# Altium schematic sheet LCD.SchDoc
size A4; Organization: Altium Limited; Address1: L3, 12a Rodborough Rd; Address2: Frenchs Forest; Address3: NSW; Address4: Australia 2086
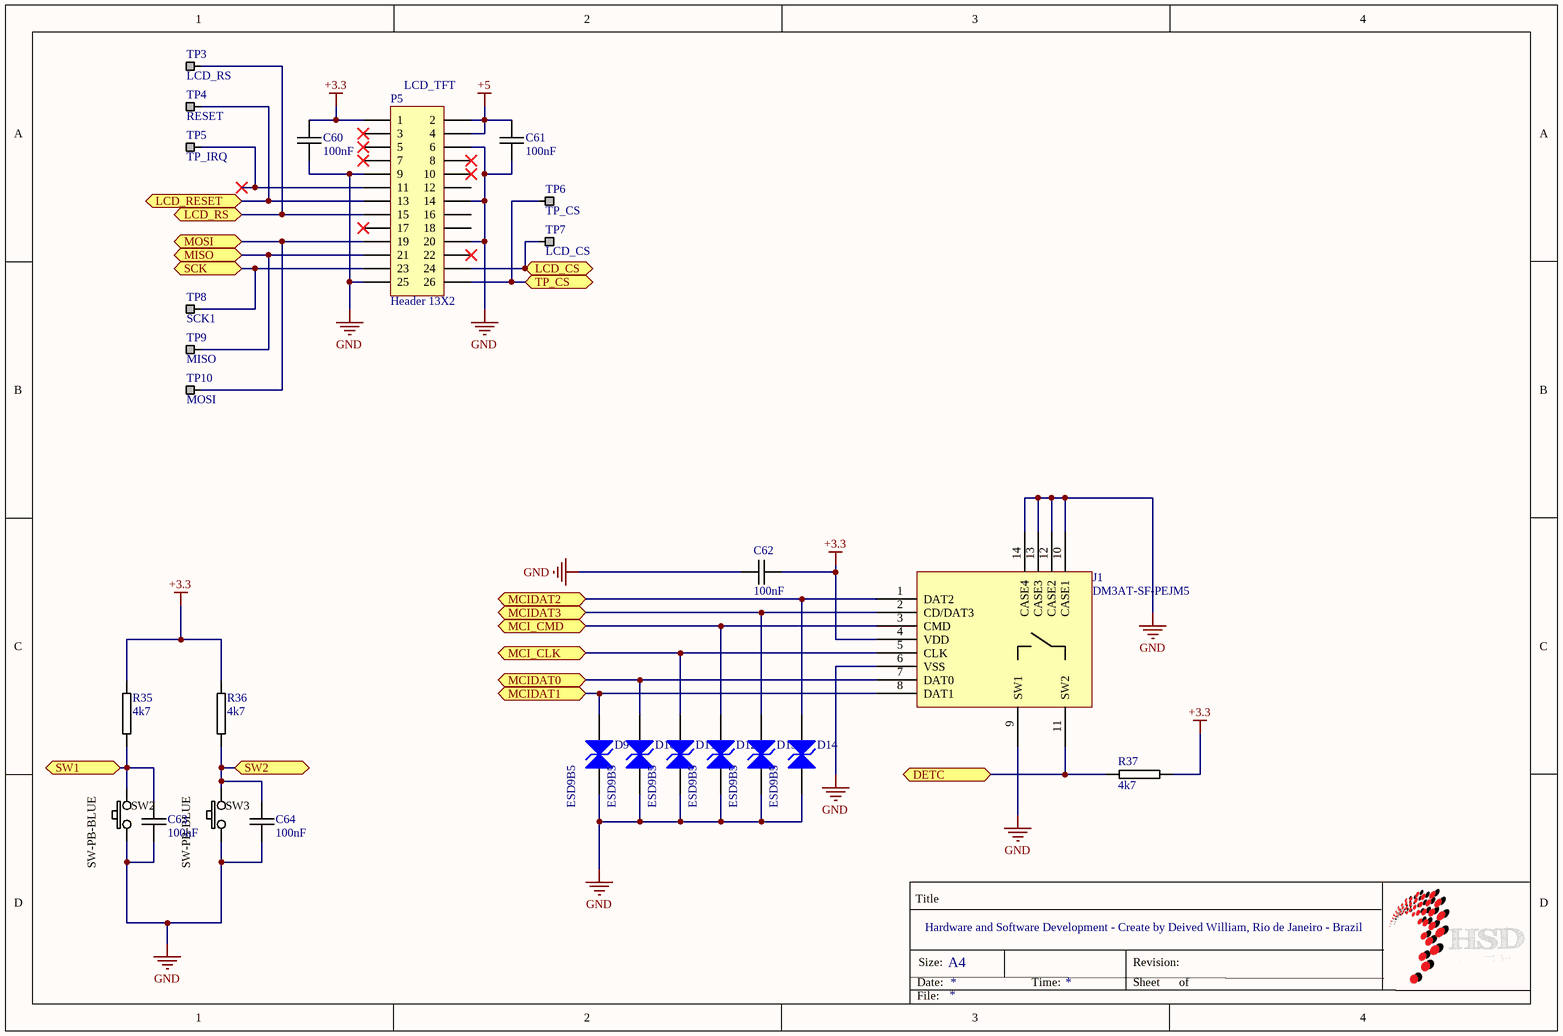
[diagram p0: LCD.SchDoc]

## Parts
C60  100nF  [0603C-GENERIC]
C61  100nF  [0603C-GENERIC]
C62  100nF  [0603C-GENERIC]
C63  100nF  [0603C-GENERIC]
C64  100nF  [0603C-GENERIC]
D9  ESD9B5  [SOD-923]
D10  ESD9B5  [SOD-923]
D11  ESD9B5  [SOD-923]
D12  ESD9B5  [SOD-923]
D13  ESD9B5  [SOD-923]
D14  ESD9B5  [SOD-923]
J1  DM3AT-SF-PEJM5  [SD CARD MICRO]
P5  Header 13X2  [HDR2X13]
R35  4k7  [0603R-100]
R36  4k7  [0603R-100]
R37  4k7  [0603R-100]
SW2  SW-PB-BLUE  [SW-PB-BLUE-ROUND4]
SW3  SW-PB-BLUE  [SW-PB-BLUE-ROUND4]
TP3  LCD_RS  [TESTPIN]
TP4  RESET  [TESTPIN]
TP5  TP_IRQ  [TESTPIN]
TP6  TP_CS  [TESTPIN]
TP7  LCD_CS  [TESTPIN]
TP8  SCK1  [TESTPIN]
TP9  MISO  [TESTPIN]
TP10  MOSI  [TESTPIN]

## Ports
DETC, LCD_CS, LCD_RESET, LCD_RS, MCI_CLK, MCI_CMD, MCIDAT0, MCIDAT1, MCIDAT2, MCIDAT3, MISO, MOSI, SCK, SW1, SW2, TP_CS

## Nets
+3.3: C60.1 C62.2 J1.4(VDD) P5.1 R35.2 R36.2 R37.2
+5: C61.1 P5.2 P5.4
GND: C60.2 C61.2 C62.1 C63.2 C64.2 D9.1 D10.1 D11.1 D12.1 D13.1 D14.1 J1.6(VSS) J1.9(SW1) J1.10(CASE1) J1.12(CASE2) J1.13(CASE3) J1.14(CASE4) P5.6 P5.9 P5.14 P5.20 P5.25 SW2.1 SW3.1
DETC: J1.11(SW2) R37.1 ; port DETC
LCD_CS: P5.24 TP7.1 ; port LCD_CS
LCD_RESET: P5.13 TP4.1 ; port LCD_RESET
LCD_RS: P5.15 TP3.1 ; port LCD_RS
MCI_CLK: D11.2 J1.5(CLK) ; port MCI_CLK
MCI_CMD: D12.2 J1.3(CMD) ; port MCI_CMD
MCIDAT0: D10.2 J1.7(DAT0) ; port MCIDAT0
MCIDAT1: D9.2 J1.8(DAT1) ; port MCIDAT1
MCIDAT2: D14.2 J1.1(DAT2) ; port MCIDAT2
MCIDAT3: D13.2 J1.2(CD/DAT3) ; port MCIDAT3
MISO: P5.21 TP9.1 ; port MISO
MOSI: P5.19 TP10.1 ; port MOSI
SCK: P5.23 TP8.1 ; port SCK
SW1: C63.1 R35.1 SW2.2 ; port SW1
SW2: C64.1 R36.1 SW3.2 ; port SW2
TP_CS: P5.26 TP6.1 ; port TP_CS
NetP5_11: P5.11 TP5.1

Not connected (* = marked no-connect by the designer): P5 3* 5* 7* 8* 10* 12 16 17* 18 22*

## Notes on the sheet
- (near P5) LCD_TFT
- Title
- Date:
- Size:
- Hardware and Software Development - Create by Deived William, Rio de Janeiro - Brazil
- A4
- Time:
- Revision:
- Sheet
- of
- File:

## Library data of the parts
C60-C64 = 0603C-100NF-25V-X7R-TDK: CAPACITOR 0603 CERAMIC; Manufacturer Part Number: C1608X7R1E104K; Manufacturer: TDK Corporation; Reel: C12; Supplier 1: Digi-Key; Supplier Part Number 1: 445-1316-2-ND
D9-D14 = ESD9B5: ESD PROTECTION DIODE
J1 = DM3AT-SF-PEJM5: Conector micro SD push/push
P5 = Header 13X2: Header, 13-Pin, Dual row; LatestRevisionDate: 17-Jul-2002; LatestRevisionNote: Re-released for DXP Platform.; Publisher: Altium Limited
R35-R37 = 0603R-100: GENERIC RESISTOR 0603; Manufacturer Part Number: RMCF 1/16 100 1% R; Manufacturer: Stackpole Electronics Inc; Reel: R24; Supplier 1: Digi-Key; Supplier Part Number 1: RMCF1/16100FRDKR-ND
SW2 SW3 = SW-PB-BLUE: SW-D6-R / SW-DS-S / SW-14X14 / SW-7X7
TP3-TP10 = TESTPIN: TESTPIN SINGLE PIN HEADER; Manufacturer 1: Sharon Long Industries; Manufacturer Part Number 1: Cut-it-yourself; Reel: TH; Supplier 1: Sharon Long Industries; Supplier 1 Part number: Cut-It-Yourself